# Altium schematic sheet SCH_MPPT_Charger_V1.SchDoc
size A3; SheetNumber: 1; SheetTotal: 2
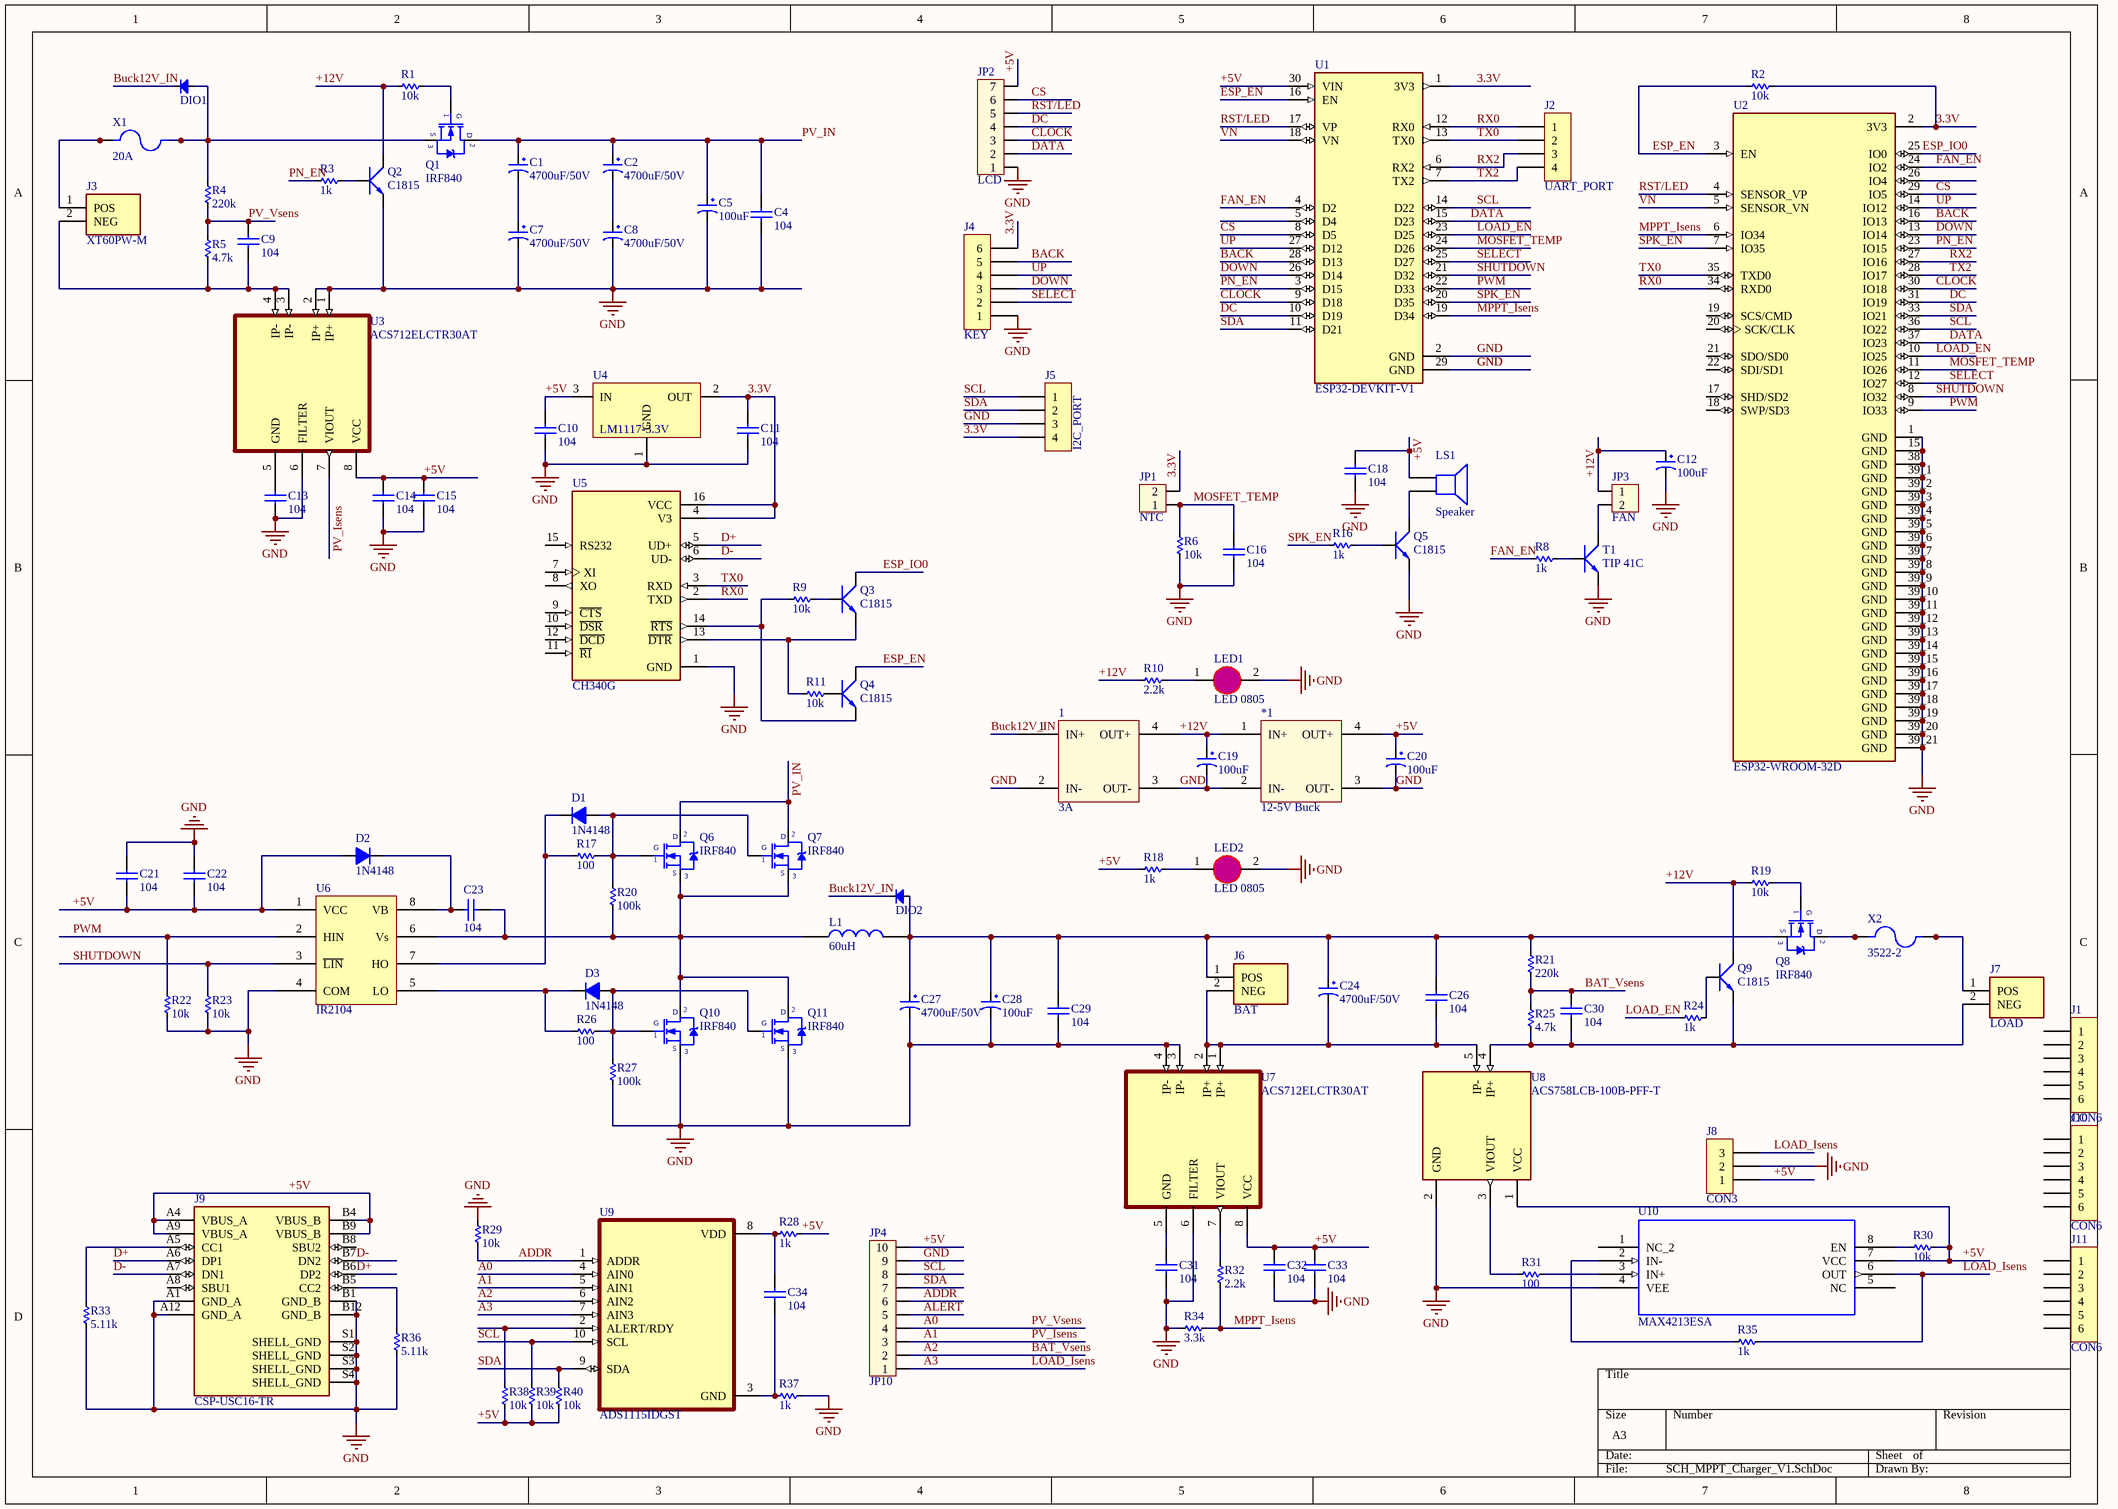
[diagram p0: SCH_MPPT_Charger_V1.SchDoc]

## Parts
1  3A  [90-12V BUCK]
*1  12-5V Buck  [12-5V BUCK]
C1  4700uF/50V  [CP4/8.5]
C2  4700uF/50V  [CP4/8.5]
C4  104  [0805]
C5  100uF  [CP1/2.5]
C7  4700uF/50V  [CP4/8.5]
C8  4700uF/50V  [CP4/8.5]
C9  104  [0805]
C10  104  [0805]
C11  104  [0805]
C12  100uF  [CP1/2.5]
C13  104  [0805]
C14  104  [0805]
C15  104  [0805]
C16  104  [0805]
C18  104  [0805]
C19  100uF  [CP1/2.5]
C20  100uF  [CP1/2.5]
C21  104  [0805]
C22  104  [0805]
C23  104  [0805]
C24  4700uF/50V  [CP4/8.5]
C26  104  [0805]
C27  4700uF/50V  [CP4/8.5]
C28  100uF  [CP1/2.5]
C29  104  [0805]
C30  104  [0805]
C31  104  [0805]
C32  104  [0805]
C33  104  [0805]
C34  104  [0805]
D1  1N4148  [D0.5A]
D2  1N4148  [D0.5A]
D3  1N4148  [D0.5A]
DIO1  Diode SMD  [DIO-SMD-106]  (value not drawn)
DIO2  Diode SMD  [DIO-SMD-106]  (value not drawn)
J1  CON6  [CON6]
J2  UART_PORT  [CON4]
J3  XT60PW-M  [AMASS_XT60PW-M]
J4  KEY  [CON6]
J5  I2C_PORT  [CON4]
J6  BAT  [AMASS_XT60PW-M]
J7  LOAD  [AMASS_XT60PW-M]
J8  CON3  [CON3]
J9  CSP-USC16-TR  [VALCON_CSP-USC16-TR]
J10  CON6  [CON6]
J11  CON6  [CON6]
JP1  NTC  [CON2]
JP2  LCD  [CON7]
JP3  FAN  [CON2]
JP4  JP10  [CON10]
L1  60uH  [100UH]
LED1  LED 0805  [LED0805]
LED2  LED 0805  [LED0805]
LS1  Speaker  [SPEAKER]
Q1  IRF840  [QTO-220]
Q2  C1815  [SOT23B]
Q3  C1815  [SOT23B]
Q4  C1815  [SOT23B]
Q5  C1815  [SOT23B]
Q6  IRF840  [QTO-220]
Q7  IRF840  [QTO-220]
Q8  IRF840  [QTO-220]
Q9  C1815  [SOT23B]
Q10  IRF840  [QTO-220]
Q11  IRF840  [QTO-220]
R1  10k  [RES-SMD-0805]
R2  10k  [RES-SMD-0805]
R3  1k  [RES-SMD-0805]
R4  220k  [RES-SMD-0805]
R5  4.7k  [RES-SMD-0805]
R6  10k  [RES-SMD-0805]
R8  1k  [RES-SMD-0805]
R9  10k  [RES-SMD-0805]
R10  2.2k  [RES-SMD-0805]
R11  10k  [RES-SMD-0805]
R16  1k  [RES-SMD-0805]
R17  100  [RES-SMD-0805]
R18  1k  [RES-SMD-0805]
R19  10k  [RES-SMD-0805]
R20  100k  [RES-SMD-0805]
R21  220k  [RES-SMD-0805]
R22  10k  [RES-SMD-0805]
R23  10k  [RES-SMD-0805]
R24  1k  [RES-SMD-0805]
R25  4.7k  [RES-SMD-0805]
R26  100  [RES-SMD-0805]
R27  100k  [RES-SMD-0805]
R28  1k  [RES-SMD-0805]
R29  10k  [RES-SMD-0805]
R30  10k  [RES-SMD-0805]
R31  100  [RES-SMD-0805]
R32  2.2k  [RES-SMD-0805]
R33  5.11k  [RES-SMD-0805]
R34  3.3k  [RES-SMD-0805]
R35  1k  [RES-SMD-0805]
R36  5.11k  [RES-SMD-0805]
R37  1k  [RES-SMD-0805]
R38  10k  [RES-SMD-0805]
R39  10k  [RES-SMD-0805]
R40  10k  [RES-SMD-0805]
T1  TIP 41C  [TO252_NEW]
U1  ESP32-DEVKIT-V1  [MODULE_ESP32_DEVKIT_V1]
U2  ESP32-WROOM-32D  [MODULE_ESP32-WROOM-32D]
U3  ACS712ELCTR30AT  [SOIC127P600X175-8N]
U4  LM1117-3.3V  [SOT223]
U5  CH340G  [SOIC127P600X180-16N]
U6  IR2104  [dip8]
U7  ACS712ELCTR30AT  [SOIC127P600X175-8N]
U8  ACS758LCB-100B-PFF-T  [XDCR_ACS770KCB-150U-PFF-T]
U9  ADS1115IDGST  [SOP50P490X110-10N]
U10  MAX4213ESA  [21-0041B_8]
X1  20A  [FUSE_3522-2]
X2  3522-2  [FUSE_3522-2]

## Nets
GND: 1.2(IN-) 1.3(OUT-) *1.2(IN-) *1.3(OUT-) C4.1 C5.2 C7.2 C8.2 C10.1 C11.1 C12.2 C13.1 C14.1 C15.1 C16.1 C18.1 C19.2 C20.2 C21.2 C22.2 C27.2 C28.2 C29.1 C31.1 C32.1 C33.1 J4.1 J5.3 J8.2 J9.A1(GND_A) J9.A12(GND_A) J9.B1(GND_B) J9.B12(GND_B) J9.S1(SHELL_GND) J9.S2(SHELL_GND) J9.S3(SHELL_GND) J9.S4(SHELL_GND) JP2.1 JP4.9 LED1.2(K) LED2.2(K) Q2.3(E) Q5.3(E) Q10.3(S) Q11.3(S) R6.2 R22.1 R23.1 R27.2 R29.2 R33.2 R34.2 R36.2 R37.1 T1.3(E) U1.2(GND) U1.29(GND) U2.1(GND) U2.15(GND) U2.38(GND) U2.39_1(GND) U2.39_2(GND) U2.39_3(GND) U2.39_4(GND) U2.39_5(GND) U2.39_6(GND) U2.39_7(GND) U2.39_8(GND) U2.39_9(GND) U2.39_10(GND) U2.39_11(GND) U2.39_12(GND) U2.39_13(GND) U2.39_14(GND) U2.39_15(GND) U2.39_16(GND) U2.39_17(GND) U2.39_18(GND) U2.39_19(GND) U2.39_20(GND) U2.39_21(GND) U3.1(IP+) U3.2(IP+) U3.6(FILTER) U4.1(GND) U5.1(GND) U6.4(COM) U7.3(IP-) U7.4(IP-) U7.6(FILTER) U8.2(GND) U10.4(VEE)
3.3V: C11.2 J4.6 J5.4 JP1.2 R2.2 U1.1(3V3) U2.2(3V3) U4.2(OUT) U5.4(V3) U5.16(VCC)
+5V: *1.4(OUT+) C10.2 C14.2 C15.2 C18.2 C20.1 C21.1 C22.1 C32.2 C33.2 D2.1(A) J8.1 J9.A4(VBUS_A) J9.A9(VBUS_A) J9.B4(VBUS_B) J9.B9(VBUS_B) JP2.7 JP4.10 LS1.1 R18.1 R28.1 R30.1 R38.2 R39.1 R40.2 U1.30(VIN) U3.8(VCC) U4.3(IN) U6.1(VCC) U7.8(VCC) U8.1(VCC) U10.7(VCC)
+12V: 1.4(OUT+) *1.1(IN+) C12.1 C19.1 JP3.1 Q2.2(C) Q9.2(C) R1.1 R10.1 R19.1
A0: C9.2 JP4.4 R4.2 R5.1 U9.4(AIN0)  [also labelled PV_Vsens]
A1: JP4.3 U3.7(VIOUT) U9.5(AIN1)  [also labelled PV_Isens]
A2: C30.2 JP4.2 R21.2 R25.1 U9.6(AIN2)  [also labelled BAT_Vsens]
A3: J8.3 JP4.1 R35.1 U9.7(AIN3) U10.6(OUT)  [also labelled LOAD_Isens]
ADDR: JP4.6 R29.1 U9.1(ADDR)
ALERT: JP4.5
BACK: J4.5 U1.28(D13) U2.16(IO13)
Buck12V_IN: 1.1(IN+) DIO1.2(K) DIO2.2(K)
CLOCK: JP2.3 U1.9(D18) U2.30(IO18)
CS: JP2.6 U1.8(D5) U2.29(IO5)
D+: J9.A6(DP1) J9.B6(DP2) U5.5(UD+)
D-: J9.A7(DN1) J9.B7(DN2) U5.6(UD-)
DATA: JP2.2 U1.15(D23) U2.37(IO23)
DC: JP2.4 U1.10(D19) U2.31(IO19)
DOWN: J4.3 U1.26(D14) U2.13(IO14)
ESP_EN: Q4.2(C) R2.1 U1.16(EN) U2.3(EN)
ESP_IO0: Q3.2(C) U2.25(IO0)
FAN_EN: R8.2 U1.4(D2) U2.24(IO2)
LOAD_EN: R24.2 U1.23(D25) U2.10(IO25)
MOSFET_TEMP: C16.2 JP1.1 R6.1 U1.24(D26) U2.11(IO26)
MPPT_Isens: R32.2 R34.1 U1.19(D34) U2.6(IO34)
PN_EN: R3.2 U1.3(D15) U2.23(IO15)
PV_IN: C1.1 C2.1 C4.2 C5.1 Q1.2(D) Q6.2(D) Q7.2(D)
PWM: R22.2 U1.22(D33) U2.9(IO33) U6.2(HIN)
RST/LED: JP2.5 U1.17(VP) U2.4(SENSOR_VP)
RX0: J2.1 U1.12(RX0) U2.34(RXD0) U5.2(TXD)
RX2: J2.3 U1.6(RX2) U2.27(IO16)
SCL: J5.1 JP4.8 R39.2 U1.14(D22) U2.36(IO22) U9.10(SCL)
SDA: J5.2 JP4.7 R40.1 U1.11(D21) U2.33(IO21) U9.9(SDA)
SELECT: J4.2 U1.25(D27) U2.12(IO27)
SHUTDOWN: R23.2 U1.21(D32) U2.8(IO32) U6.3(~{LIN})
SPK_EN: R16.2 U1.20(D35) U2.7(IO35)
TX0: J2.2 U1.13(TX0) U2.35(TXD0) U5.3(RXD)
TX2: J2.4 U1.7(TX2) U2.28(IO17)
UP: J4.4 U1.27(D12) U2.14(IO12)
VN: U1.18(VN) U2.5(SENSOR_VN)
NetC1_2: C1.2 C7.1
NetC2_2: C2.2 C8.1
NetC9_1: C9.1 J3.2(NEG) R5.2 U3.3(IP-) U3.4(IP-)
NetC13_2: C13.2 U3.5(GND)
NetC23_1: C23.1 L1.1 Q6.3(S) Q7.3(S) Q10.2(D) Q11.2(D) R20.2 U6.6(Vs)
NetC23_2: C23.2 D2.2(K) U6.8(VB)
NetC24_1: C24.1 C26.2 C27.1 C28.1 C29.2 DIO2.1(A) J6.1(POS) L1.2 Q8.3(S) R21.1
NetC24_2: C24.2 C26.1 J6.2(NEG) U7.1(IP+) U7.2(IP+) U8.5(IP-)
NetC30_1: C30.1 J7.2(NEG) Q9.3(E) R25.2 U8.4(IP+)
NetC31_2: C31.2 U7.5(GND)
NetC34_1: C34.1 R37.2 U9.3(GND)
NetC34_2: C34.2 R28.2 U9.8(VDD)
NetD1_1: D1.1(A) Q6.1(G) Q7.1(G) R17.1 R20.1
NetD1_2: D1.2(K) R17.2 U6.7(HO)
NetD3_1: D3.1(A) Q10.1(G) Q11.1(G) R26.2 R27.1
NetD3_2: D3.2(K) R26.1 U6.5(LO)
NetDIO1_1: DIO1.1(A) Q1.3(S) R4.1 X1.2A X1.2B
NetJ3_1: J3.1(POS) X1.1A X1.1B
NetJ7_1: J7.1(POS) X2.2A X2.2B
NetJ9_A5: J9.A5(CC1) R33.1
NetJ9_B5: J9.B5(CC2) R36.1
NetJP3_2: JP3.2 T1.2(C)
NetLED1_1: LED1.1(A) R10.2
NetLED2_1: LED2.1(A) R18.2
NetLS1_2: LS1.2 Q5.2(C)
NetQ1_1: Q1.1(G) R1.2
NetQ2_1: Q2.1(B) R3.1
NetQ3_1: Q3.1(B) R9.2
NetQ3_3: Q3.3(E) R11.1 U5.13(~{DTR})
NetQ4_1: Q4.1(B) R11.2
NetQ4_3: Q4.3(E) R9.1 U5.14(~{RTS})
NetQ5_1: Q5.1(B) R16.1
NetQ8_1: Q8.1(G) R19.2
NetQ8_2: Q8.2(D) X2.1A X2.1B
NetQ9_1: Q9.1(B) R24.1
NetR8_1: R8.1 T1.1(B)
NetR30_2: R30.2 U10.8(EN)
NetR31_1: R31.1 U10.3(IN+)
NetR31_2: R31.2 U8.3(VIOUT)
NetR32_1: R32.1 U7.7(VIOUT)
NetR35_2: R35.2 U10.2(IN-)
NetR38_1: R38.1 U9.2(ALERT/RDY)

Not connected (* = marked no-connect by the designer): J1 1 2 3 4 5 6; J9 A8(SBU1) B8(SBU2); J10 1 2 3 4 5 6; J11 1 2 3 4 5 6; U1 5(D4); U2 17(SHD/SD2) 18(SWP/SD3) 19(SCS/CMD) 20(SCK/CLK) 21(SDO/SD0) 22(SDI/SD1) 26(IO4); U5 7(XI) 8(XO) 9(~{CTS}) 10(~{DSR}) 11(~{RI}) 12(~{DCD}) 15(RS232); U10 1(NC_2) 5(NC)

## Library data of the parts
1 = 90-12V  Buck
*1 = 12-5V Buck: 3A
C1 C2 C7 C8 C24 C27 = CP7: Cap 4700uF/50V; Value: 4700uF/50V
C4 C9-C11 C13-C16 C18 C21-C23 C26 C29-C34 = Cap 104: Capacitor (Semiconductor SIM Model); Value: 0.1uF; Published: 8-Jun-2000; LatestRevisionDate: 17-Jul-2002; LatestRevisionNote: Re-released for DXP Platform.; PackageReference: C1206; Publisher: Altium Limited
C5 C12 C19 C20 C28 = CP2: C 47uF/50V , 220uF/16V; Value: 47uF/16 - 50V; Description 1: 470uF/6,3V - 330uF/10V - 220uF/16V; Description 2: 100uF/25V - 35V - 47uF/50V - 22uF/100V; Description 3: 33uF => 47uF/63V - 1uF => 4,7uF/160V; Description 4: 1uF => 2,2uF/250V - 1uF/350V
D1-D3 = D0.5A: Value: 1N4148
DIO1 DIO2 = Diode SMD: Default Diode; Code - JEDEC: DO-214-AB; Value: 1N5007; Published: 8-Jun-2000; Revision: July-2002: Re-released for DXP Platform.; Publisher: Altium Limited
J1 J4 J10 J11 = CON6: Connector
J2 J5 = CON4: Connector
J3 J6 J7 = XT60PW-M: Socket, DC supply, male, PIN: 2; MF: AMASS; Check_prices: https://www.snapeda.com/parts/XT60PW-M/AMASS/view-part/?ref=eda; SnapEDA_Link: https://www.snapeda.com/parts/XT60PW-M/AMASS/view-part/?ref=snap; Price: None; Availability: Not in stock; Package: Package; MP: XT60PW-M; Value: *
J8 = CON3: Connector
J9 = CSP-USC16-TR: CSP-USC16-TR Valcon USB Type C Surface Mount PCB Socket; SnapEDA_Link: https://www.snapeda.com/parts/CSP-USC16-TR/Valcon/view-part/?ref=snap; MF: Valcon; MP: CSP-USC16-TR; Availability: In Stock; Price: None; Value: *; Check_prices: https://www.snapeda.com/parts/CSP-USC16-TR/Valcon/view-part/?ref=eda; Package: None; Purchase-URL: https://pricing.snapeda.com/search/part/CSP-USC16-TR/?ref=eda
JP1 JP3 = CON2: Connector 2; Value: Connector 2
JP2 = Con7: Connector 7; Value: Connector 7
JP4 = Con10: Connector 10; Value: Connector 10
L1 = INDUCTOR
LED1 LED2 = LEDSMD: Dán; Don_Vi: Con; Ten_Linh_Kien: *; Ma_Hang: *; Ghi_Chu: *; Kieu_Chan: *; Chung_Loai: Dán
LS1 = Speaker: Loudspeaker; Published: 24-Mar-1999; LatestRevisionDate: 17-Jul-2002; LatestRevisionNote: Re-released for DXP Platform.; PackageReference: PIN2; Publisher: Altium Limited
Q1 Q6-Q8 Q10 Q11 = IRF840: MOSFET N - CHANNEL 500V - 0.75 - 8A - TO-220; Value: IRF840
Q2-Q5 Q9 = C1815: Dán; Ten_Linh_Kien: C1815 SOT23 TRANS NPN 0.15A 50V (SMD-HF); Don_Vi: Con; Ma_Hang: MH000946; Ghi_Chu: *; Kieu_Chan: *; Chung_Loai: Dán
R1-R6 R8-R11 R16-R40 = Res-SMD: Resistor; Manufacturer: Generic Components; Class: Passive; Published: 08/06/2000; Publisher: Altium Hobart Technology Centre
T1 = TIP41C_SMD: Dán; Don_Vi: Con; Ma_Hang: MH007260; Ten_Linh_Kien: TIP42C TO252 TRANS PNP 6A 100V (SMD-J42C); Chung_Loai: Dán; Kieu_Chan: *; Ghi_Chu: *
U1 = ESP32-DEVKIT-V1: Dual core, Wi-Fi: 2.4 GHz up to 150 Mbits/s,BLE (Bluetooth Low Energy) and legacy Bluetooth, 32 bits, Up to 240 MHz; MF: Do it; Price: None; Availability: Not in stock; Package: None; MP: ESP32-DEVKIT-V1; Value: *; SnapEDA_Link: https://www.snapeda.com/parts/ESP32-DEVKIT-V1/Do+it/view-part/?ref=snap; Check_prices: https://www.snapeda.com/parts/ESP32-DEVKIT-V1/Do+it/view-part/?ref=eda
U2 = ESP32-WROOM-32D: Bluetooth, WiFi 802.11b/g/n, Bluetooth v4.2 +EDR, Class 1, 2 and 3 Transceiver Module 2.4GHz ~ 2.5GHz Integrated; MF: Espressif Systems; Price: None; Availability: In Stock; Package: Module Espressif Systems; MP: ESP32-WROOM-32D; Value: *; SnapEDA_Link: https://www.snapeda.com/parts/ESP32-WROOM-32D/Espressif+Systems/view-part/?ref=snap; Purchase-URL: https://pricing.snapeda.com/search/part/ESP32-WROOM-32D/?ref=eda; Check_prices: https://www.snapeda.com/parts/ESP32-WROOM-32D/Espressif+Systems/view-part/?ref=eda
U3 U7 = ACS712ELCTR30AT: Current Sensor 30A 1 Channel Hall Effect, Open Loop Bidirectional 8-SOIC (0.154, 3.90mm Width); MP: ACS712ELCTR-30A-T; MF: Allegro; Price: None; Availability: In Stock; Package: SOIC-8 Allegro MicroSystems LLC; SnapEDA_Link: https://www.snapeda.com/parts/ACS712ELCTR-30A-T/Allegro+Industries/view-part/?ref=snap; Check_prices: https://www.snapeda.com/parts/ACS712ELCTR-30A-T/Allegro+Industries/view-part/?ref=eda; Value: *; Purchase-URL: https://pricing.snapeda.com/search/part/ACS712ELCTR-30A-T/?ref=eda
U4 = LM1117: 800mA Low-Dropout Linear Regulator; Creator: Nguyen Ba Bien; Website: http://group3i.net
U5 = CH340G: USB Interface Integrated Circuit; MF: WCH; Value: *; SnapEDA_Link: https://www.snapeda.com/parts/Ch340G/WCH/view-part/?ref=snap; MP: Ch340G; Check_prices: https://www.snapeda.com/parts/Ch340G/WCH/view-part/?ref=eda; Availability: Not in stock; Price: None; Package: None
U6 = IR2103
U8 = ACS758LCB-100B-PFF-T: Current Sensor 100A 1 Channel Hall Effect, Open Loop Bidirectional 5-CB Formed Leads, PFF; MF: Allegro; Price: None; Availability: In Stock; Package: 5-CB-5 Allegro MicroSystems LLC; MP: ACS758LCB-100B-PFF-T; Value: *; SnapEDA_Link: https://www.snapeda.com/parts/ACS758LCB-100B-PFF-T/Allegro+Industries/view-part/?ref=snap; Purchase-URL: https://pricing.snapeda.com/search/part/ACS758LCB-100B-PFF-T/?ref=eda; Check_prices: https://www.snapeda.com/parts/ACS758LCB-100B-PFF-T/Allegro+Industries/view-part/?ref=eda
X1 X2 = 3522-2: MF: {'manufacturer': u'Keystone Electronics'}; Availability: Unavailable; Price: None; Value: *; MP: 3522-2; Package: None
U9 = ADS1115IDGST: MP: ADS1115IDGST; Value: *; Price: None; Package: None; Availability: Unavailable
U10 = MAX4213ESA: Package: None; Price: None; Value: *; MP: MAX4213ESA; Availability: Unavailable